# Altium schematic sheet Jlink_V9.SchDoc
size A4
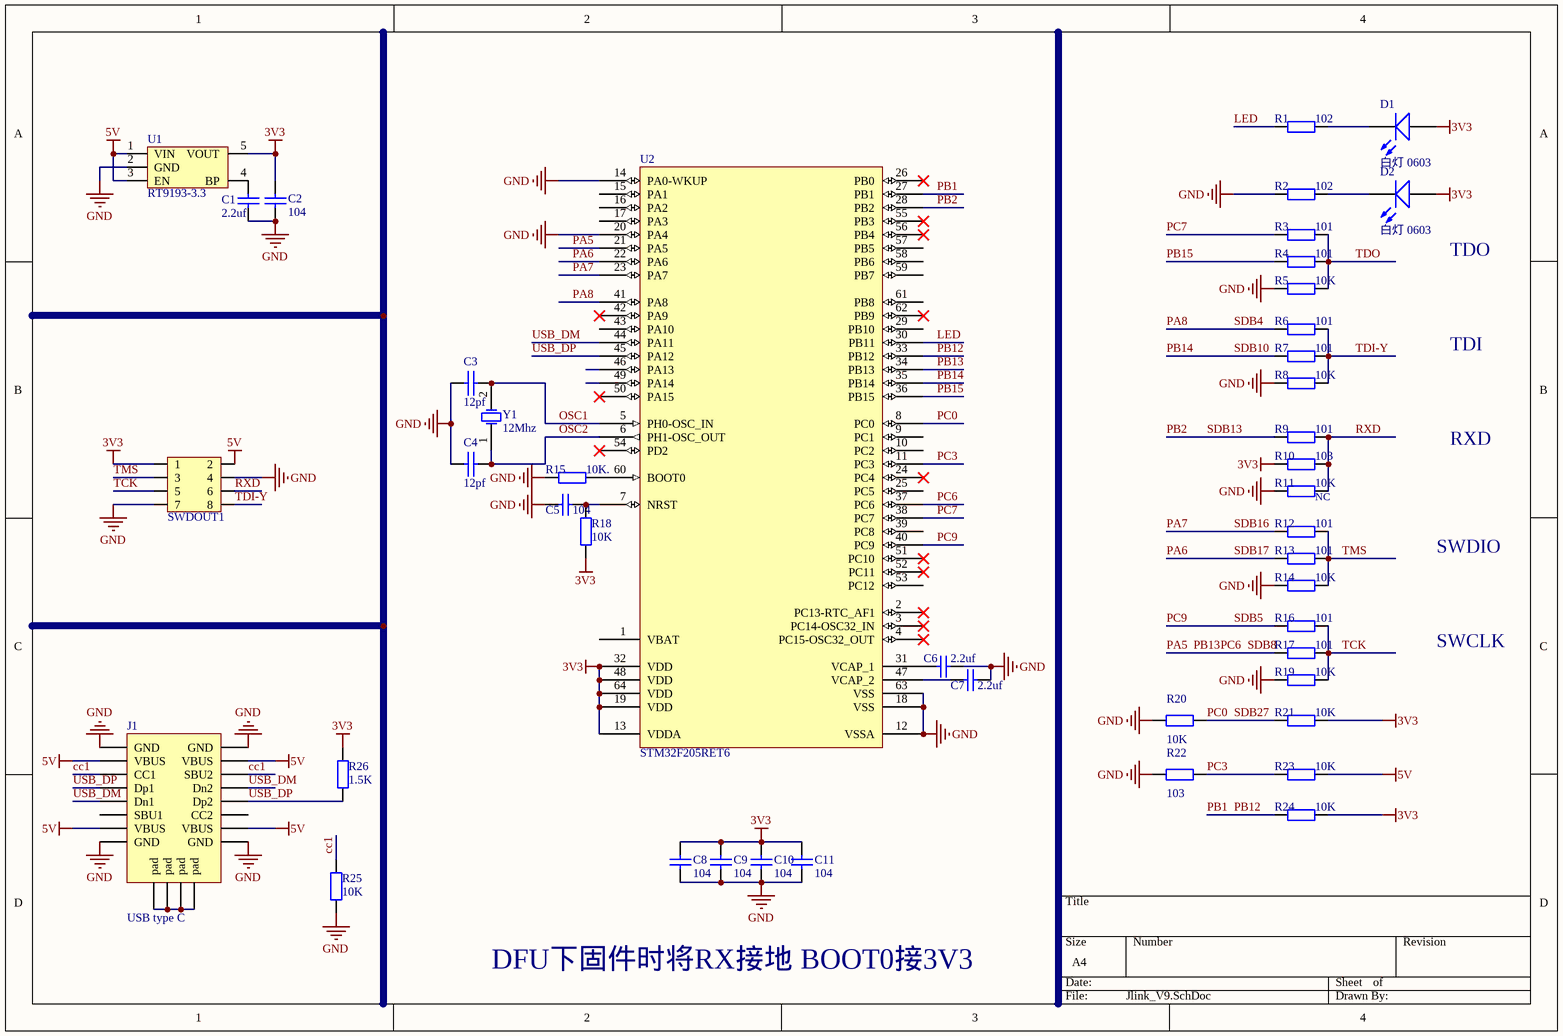
[diagram p0: Jlink_V9.SchDoc]

## Parts
C1  value 2.2uf  [LC-0603_C]  (hidden comment: Cap)
C2  value 104  [LC-0603_C]  (hidden comment: Cap)
C3  12pf  [LC-0603_C]
C4  12pf  [LC-0603_C]
C5  value 104  [LC-0603_C]  (hidden comment: Cap)
C6  value 2.2uf  [LC-0603_C]  (hidden comment: Cap)
C7  value 2.2uf  [LC-0603_C]  (hidden comment: Cap)
C8  value 104  [LC-0603_C]  (hidden comment: Cap)
C9  value 104  [LC-0603_C]  (hidden comment: Cap)
C10  value 104  [LC-0603_C]  (hidden comment: Cap)
C11  value 104  [LC-0603_C]  (hidden comment: Cap)
D1  白灯 0603  [0603_LED_S1]
D2  白灯 0603  [0603_LED_S1]
J1  USB type C  [USB Type-C-16Pin_A]
R1  value 102  [LC-0603_R]  (hidden comment: Resistor Chip)
R2  value 102  [LC-0603_R]  (hidden comment: Resistor Chip)
R3  value 101  [LC-0603_R]  (hidden comment: Resistor Chip)
R4  value 101  [LC-0603_R]  (hidden comment: Resistor Chip)
R5  value 10K  [LC-0603_R]  (hidden comment: Resistor Chip)
R6  value 101  [LC-0603_R]  (hidden comment: Resistor Chip)
R7  value 101  [LC-0603_R]  (hidden comment: Resistor Chip)
R8  value 10K  [LC-0603_R]  (hidden comment: Resistor Chip)
R9  value 101  [LC-0603_R]  (hidden comment: Resistor Chip)
R10  value 103  [LC-0603_R]  (hidden comment: Resistor Chip)
R11  value 10K  [LC-0603_R]  (hidden comment: Resistor Chip)
R12  value 101  [LC-0603_R]  (hidden comment: Resistor Chip)
R13  value 101  [LC-0603_R]  (hidden comment: Resistor Chip)
R14  value 10K  [LC-0603_R]  (hidden comment: Resistor Chip)
R15  value 10K.  [LC-0603_R]  (hidden comment: Resistor Chip)
R16  value 101  [LC-0603_R]  (hidden comment: Resistor Chip)
R17  value 101  [LC-0603_R]  (hidden comment: Resistor Chip)
R18  value 10K  [LC-0603_R]  (hidden comment: Resistor Chip)
R19  value 10K  [LC-0603_R]  (hidden comment: Resistor Chip)
R20  value 10K  [LC-0603_R]  (hidden comment: Resistor Chip)
R21  value 10K  [LC-0603_R]  (hidden comment: Resistor Chip)
R22  value 103  [LC-0603_R]  (hidden comment: Resistor Chip)
R23  value 10K  [LC-0603_R]  (hidden comment: Resistor Chip)
R24  value 10K  [LC-0603_R]  (hidden comment: Resistor Chip)
R25  value 10K  [LC-0603_R]  (hidden comment: Res2)
R26  value 1.5K  [LC-0603_R]  (hidden comment: Res2)
SWDOUT1  HDR2x6_2.54  [HDR2X4_2.54_180H]  (value not drawn)
U1  RT9193-3.3  [SOT23-5N]
U2  STM32F205RET6  [LQFP64 10x10_N]
Y1  12Mhz  [XT_5032_2]

## Nets
3V3: C2.2 C8.2 C9.2 C10.2 C11.2 D1.A D2.A R10.1 R18.1 R21.2 R24.2 R26.1 SWDOUT1.1 U1.5(VOUT) U2.13(VDDA) U2.19(VDD) U2.32(VDD) U2.48(VDD) U2.64(VDD)
5V: J1.A4(VBUS) J1.A9(VBUS) J1.B4(VBUS) J1.B9(VBUS) R23.2 SWDOUT1.2 U1.1(VIN) U1.3(EN)
GND: C1.1 C2.1 C3.1 C4.2 C5.2 C6.1 C7.1 C8.1 C9.1 C10.1 C11.1 J1.A1(GND) J1.A12(GND) J1.B1(GND) J1.B12(GND) R2.1 R5.1 R8.1 R11.1 R14.1 R15.1 R19.1 R20.1 R22.1 R25.2 SWDOUT1.4 SWDOUT1.7 U1.2(GND) U2.12(VSSA) U2.14(PA0-WKUP) U2.18(VSS) U2.20(PA4) U2.63(VSS)
cc1: J1.A5(CC1) J1.B8(SBU2) R25.1
LED: R1.1 U2.30(PB11)
OSC1: C3.2 U2.5(PH0-OSC_IN) Y1.2(OSC2)
OSC2: C4.1 U2.6(PH1-OSC_OUT) Y1.1(OSC1)
PA5: R17.1 U2.21(PA5) U2.34(PB13) U2.37(PC6)  [also labelled PB13, PC6, SDB8]
PA6: R13.1 U2.22(PA6)  [also labelled SDB17]
PA7: R12.1 U2.23(PA7)  [also labelled SDB16]
PA8: R6.1 U2.41(PA8)  [also labelled SDB4]
PB1: R24.1 U2.27(PB1) U2.33(PB12)  [also labelled PB12]
PB2: R9.1 U2.28(PB2)  [also labelled SDB13]
PB14: R7.1 U2.35(PB14)  [also labelled SDB10]
PB15: R4.1 U2.36(PB15)
PC0: R20.2 R21.1 U2.8(PC0)  [also labelled SDB27]
PC3: R22.2 R23.1 U2.11(PC3)
PC7: R3.1 U2.38(PC7)
PC9: R16.1 U2.40(PC9)  [also labelled SDB5]
RXD: R9.2 R10.2 R11.2 SWDOUT1.6
TCK: R16.2 R17.2 R19.2 SWDOUT1.5
TDI-Y: R6.2 R7.2 R8.2 SWDOUT1.8
TDO: R3.2 R4.2 R5.2
TMS: R12.2 R13.2 R14.2 SWDOUT1.3
USB_DM: J1.A7(Dn1) J1.B7(Dn2) U2.44(PA11)
USB_DP: J1.A6(Dp1) J1.B6(Dp2) R26.2 U2.45(PA12)
NetC1_2: C1.2 U1.4(BP)
NetC5_1: C5.1 R18.2 U2.7(NRST)
NetC6_2: C6.2 U2.31(VCAP_1)
NetC7_2: C7.2 U2.47(VCAP_2)
NetD1_K: D1.K R1.2
NetD2_K: D2.K R2.2
NetR15_2: R15.2 U2.60(BOOT0)

Not connected (* = marked no-connect by the designer): J1 0(pad) A8(SBU1) B5(CC2); U2 1(VBAT) 2(PC13-RTC_AF1)* 3(PC14-OSC32_IN)* 4(PC15-OSC32_OUT)* 9(PC1) 10(PC2) 15(PA1) 16(PA2) 17(PA3) 24(PC4)* 25(PC5) 26(PB0)* 29(PB10) 39(PC8) 42(PA9)* 43(PA10) 46(PA13) 49(PA14) 50(PA15)* 51(PC10)* 52(PC11)* 53(PC12) 54(PD2)* 55(PB3)* 56(PB4)* 57(PB5) 58(PB6) 59(PB7) 61(PB8) 62(PB9)*

## Notes on the sheet
- TDO
- TDI
- RXD
- (near R11) NC
- SWDIO
- SWCLK
- DFU下固件时将RX接地 BOOT0接3V3

## Library data of the parts
C1 C2 C5-C11 = Cap: Polarized Capacitor (Radial); Published: 8-Jun-2000; Revision: July-2002: Re-released for DXP Platform.; Publisher: Altium Limited
C3 C4 = CAP
D1 D2 = 0603 白灯: 发光二极管; ComponentLink1Description: 供应商链接; ComponentLink1URL: http://www.szlcsc.com/product/details_2663.html; Package: 0603; Supplier: LC; SuppliersPartNumber: C2290
J1 = USB_C
R1-R24 = Resistor: Published: 8-Jun-2000; Revision: July-2002: Re-released for DXP Platform.; Publisher: Altium Limited
R25 R26 = Res2: Resistor; Published: 8-Jun-2000; LatestRevisionDate: 17-Jul-2002; LatestRevisionNote: Re-released for DXP Platform.; PackageReference: AXIAL-0.4; Publisher: Altium Limited
SWDOUT1 = HDR2x4_2.54: Header
U1 = RT9193-33: 3.3V超低压差LDO
U2 = STM32F205RET6: Microcontroller   ST; Code: 104261; Vision: V5.0; Value: STM32F205RET6; LatestRevisionDate: 25-Mar-2015; PackageReference: SQFP10x10-64; Brand: ST; InitialReleaseDate: 25-Mar-2015
Y1 = XTAL_1: Crystal Oscillator; Published: 8-Jun-2000; LatestRevisionDate: 17-Jul-2002; LatestRevisionNote: Re-released for DXP Platform.; PackageReference: R38; Publisher: Altium Limited; PackageDescription: Crystal, Thru-Hole; 2 Leads; Body 3.1 x 8.2 mm (Dia.xH)